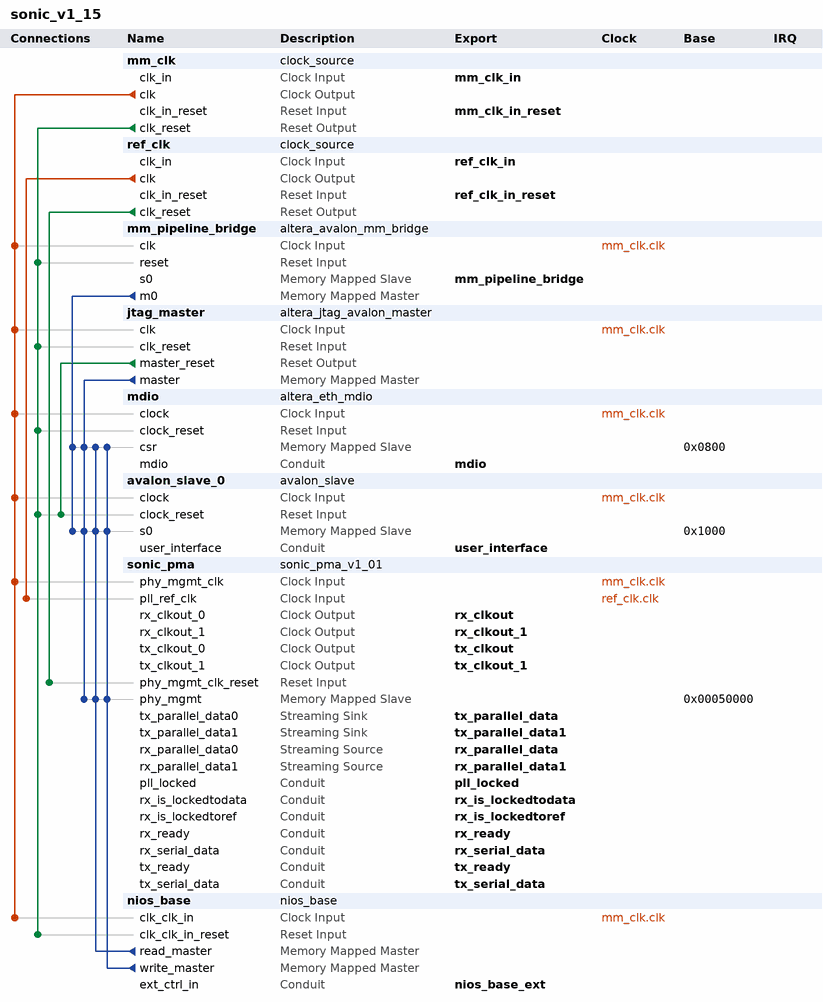
[diagram p0: system contents]
# Platform Designer (Qsys) system sonic_v1_15
# Parameters at their usual value, and those the tool derives, are not listed.
package require -exact qsys 11.0
create_system sonic_v1_15
set_project_property DEVICE_FAMILY STRATIXIV

add_instance mm_clk clock_source 11.0
set_instance_parameter_value mm_clk clockFrequency 50000000

add_instance ref_clk clock_source 11.0
set_instance_parameter_value ref_clk clockFrequency 644153000

add_instance mm_pipeline_bridge altera_avalon_mm_bridge 11.0
set_instance_parameter_value mm_pipeline_bridge DATA_WIDTH 32
set_instance_parameter_value mm_pipeline_bridge ADDRESS_WIDTH 19
set_instance_parameter_value mm_pipeline_bridge ADDRESS_UNITS SYMBOLS
set_instance_parameter_value mm_pipeline_bridge MAX_PENDING_RESPONSES 4

add_instance jtag_master altera_jtag_avalon_master 11.0

add_instance mdio altera_eth_mdio 11.0
set_instance_parameter_value mdio MDC_DIVISOR 32

add_instance avalon_slave_0 avalon_slave 2.0
set_instance_parameter_value avalon_slave_0 DATA_WIDTH 32
set_instance_parameter_value avalon_slave_0 ENABLE_SYNC_SIGNALS 0
set_instance_parameter_value avalon_slave_0 MODE_0 2
set_instance_parameter_value avalon_slave_0 MODE_1 4
set_instance_parameter_value avalon_slave_0 MODE_2 1
set_instance_parameter_value avalon_slave_0 MODE_3 1
set_instance_parameter_value avalon_slave_0 MODE_4 4
set_instance_parameter_value avalon_slave_0 MODE_5 4
set_instance_parameter_value avalon_slave_0 MODE_6 4
set_instance_parameter_value avalon_slave_0 MODE_7 4
set_instance_parameter_value avalon_slave_0 MODE_8 4
set_instance_parameter_value avalon_slave_0 MODE_9 4
set_instance_parameter_value avalon_slave_0 MODE_10 4
set_instance_parameter_value avalon_slave_0 MODE_11 4
set_instance_parameter_value avalon_slave_0 MODE_12 4
set_instance_parameter_value avalon_slave_0 MODE_13 4
set_instance_parameter_value avalon_slave_0 MODE_14 4
set_instance_parameter_value avalon_slave_0 MODE_15 4
set_instance_parameter_value avalon_slave_0 IRQ_EN 1

add_instance sonic_pma sonic_pma_v1_01 1.0

add_instance nios_base nios_base 1.0

# connections
add_connection mm_clk.clk avalon_slave_0.clock clock
add_connection mm_clk.clk jtag_master.clk clock
add_connection mm_clk.clk mdio.clock clock
add_connection mm_clk.clk mm_pipeline_bridge.clk clock
add_connection mm_clk.clk nios_base.clk_clk_in clock
add_connection mm_clk.clk sonic_pma.phy_mgmt_clk clock
add_connection ref_clk.clk sonic_pma.pll_ref_clk clock
add_connection jtag_master.master_reset avalon_slave_0.clock_reset reset
add_connection mm_clk.clk_reset avalon_slave_0.clock_reset reset
add_connection mm_clk.clk_reset jtag_master.clk_reset reset
add_connection mm_clk.clk_reset mdio.clock_reset reset
add_connection mm_clk.clk_reset mm_pipeline_bridge.reset reset
add_connection mm_clk.clk_reset nios_base.clk_clk_in_reset reset
add_connection ref_clk.clk_reset sonic_pma.phy_mgmt_clk_reset reset
add_connection jtag_master.master avalon_slave_0.s0 avalon
set_connection_parameter_value jtag_master.master/avalon_slave_0.s0 baseAddress 0x1000
add_connection jtag_master.master mdio.csr avalon
set_connection_parameter_value jtag_master.master/mdio.csr baseAddress 0x0800
add_connection jtag_master.master sonic_pma.phy_mgmt avalon
set_connection_parameter_value jtag_master.master/sonic_pma.phy_mgmt baseAddress 0x00050000
add_connection mm_pipeline_bridge.m0 avalon_slave_0.s0 avalon
set_connection_parameter_value mm_pipeline_bridge.m0/avalon_slave_0.s0 baseAddress 0x1000
add_connection mm_pipeline_bridge.m0 mdio.csr avalon
set_connection_parameter_value mm_pipeline_bridge.m0/mdio.csr baseAddress 0x0800
add_connection nios_base.read_master avalon_slave_0.s0 avalon
set_connection_parameter_value nios_base.read_master/avalon_slave_0.s0 baseAddress 0x1000
add_connection nios_base.read_master mdio.csr avalon
set_connection_parameter_value nios_base.read_master/mdio.csr baseAddress 0x0800
add_connection nios_base.read_master sonic_pma.phy_mgmt avalon
set_connection_parameter_value nios_base.read_master/sonic_pma.phy_mgmt baseAddress 0x00050000
add_connection nios_base.write_master avalon_slave_0.s0 avalon
set_connection_parameter_value nios_base.write_master/avalon_slave_0.s0 baseAddress 0x1000
add_connection nios_base.write_master mdio.csr avalon
set_connection_parameter_value nios_base.write_master/mdio.csr baseAddress 0x0800
add_connection nios_base.write_master sonic_pma.phy_mgmt avalon
set_connection_parameter_value nios_base.write_master/sonic_pma.phy_mgmt baseAddress 0x00050000

# exported interfaces
add_interface mm_clk_in clock sink
set_interface_property mm_clk_in EXPORT_OF mm_clk.clk_in
add_interface mm_clk_in_reset reset sink
set_interface_property mm_clk_in_reset EXPORT_OF mm_clk.clk_in_reset
add_interface mdio conduit end
set_interface_property mdio EXPORT_OF mdio.mdio
add_interface ref_clk_in clock sink
set_interface_property ref_clk_in EXPORT_OF ref_clk.clk_in
add_interface ref_clk_in_reset reset sink
set_interface_property ref_clk_in_reset EXPORT_OF ref_clk.clk_in_reset
add_interface mm_pipeline_bridge avalon slave
set_interface_property mm_pipeline_bridge EXPORT_OF mm_pipeline_bridge.s0
add_interface user_interface conduit end
set_interface_property user_interface EXPORT_OF avalon_slave_0.user_interface
add_interface tx_serial_data conduit end
set_interface_property tx_serial_data EXPORT_OF sonic_pma.tx_serial_data
add_interface rx_serial_data conduit end
set_interface_property rx_serial_data EXPORT_OF sonic_pma.rx_serial_data
add_interface pll_locked conduit end
set_interface_property pll_locked EXPORT_OF sonic_pma.pll_locked
add_interface rx_is_lockedtoref conduit end
set_interface_property rx_is_lockedtoref EXPORT_OF sonic_pma.rx_is_lockedtoref
add_interface rx_is_lockedtodata conduit end
set_interface_property rx_is_lockedtodata EXPORT_OF sonic_pma.rx_is_lockedtodata
add_interface tx_clkout clock source
set_interface_property tx_clkout EXPORT_OF sonic_pma.tx_clkout_0
add_interface rx_clkout clock source
set_interface_property rx_clkout EXPORT_OF sonic_pma.rx_clkout_0
add_interface rx_parallel_data avalon_streaming source
set_interface_property rx_parallel_data EXPORT_OF sonic_pma.rx_parallel_data0
add_interface tx_parallel_data avalon_streaming sink
set_interface_property tx_parallel_data EXPORT_OF sonic_pma.tx_parallel_data0
add_interface tx_ready conduit end
set_interface_property tx_ready EXPORT_OF sonic_pma.tx_ready
add_interface rx_ready conduit end
set_interface_property rx_ready EXPORT_OF sonic_pma.rx_ready
add_interface nios_base_ext conduit end
set_interface_property nios_base_ext EXPORT_OF nios_base.ext_ctrl_in
add_interface rx_parallel_data1 avalon_streaming source
set_interface_property rx_parallel_data1 EXPORT_OF sonic_pma.rx_parallel_data1
add_interface tx_parallel_data1 avalon_streaming sink
set_interface_property tx_parallel_data1 EXPORT_OF sonic_pma.tx_parallel_data1
add_interface tx_clkout_1 clock source
set_interface_property tx_clkout_1 EXPORT_OF sonic_pma.tx_clkout_1
add_interface rx_clkout_1 clock source
set_interface_property rx_clkout_1 EXPORT_OF sonic_pma.rx_clkout_1

save_system sonic_v1_15.qsys
